# EAGLE design team13 (EAGLE 8.6.3)
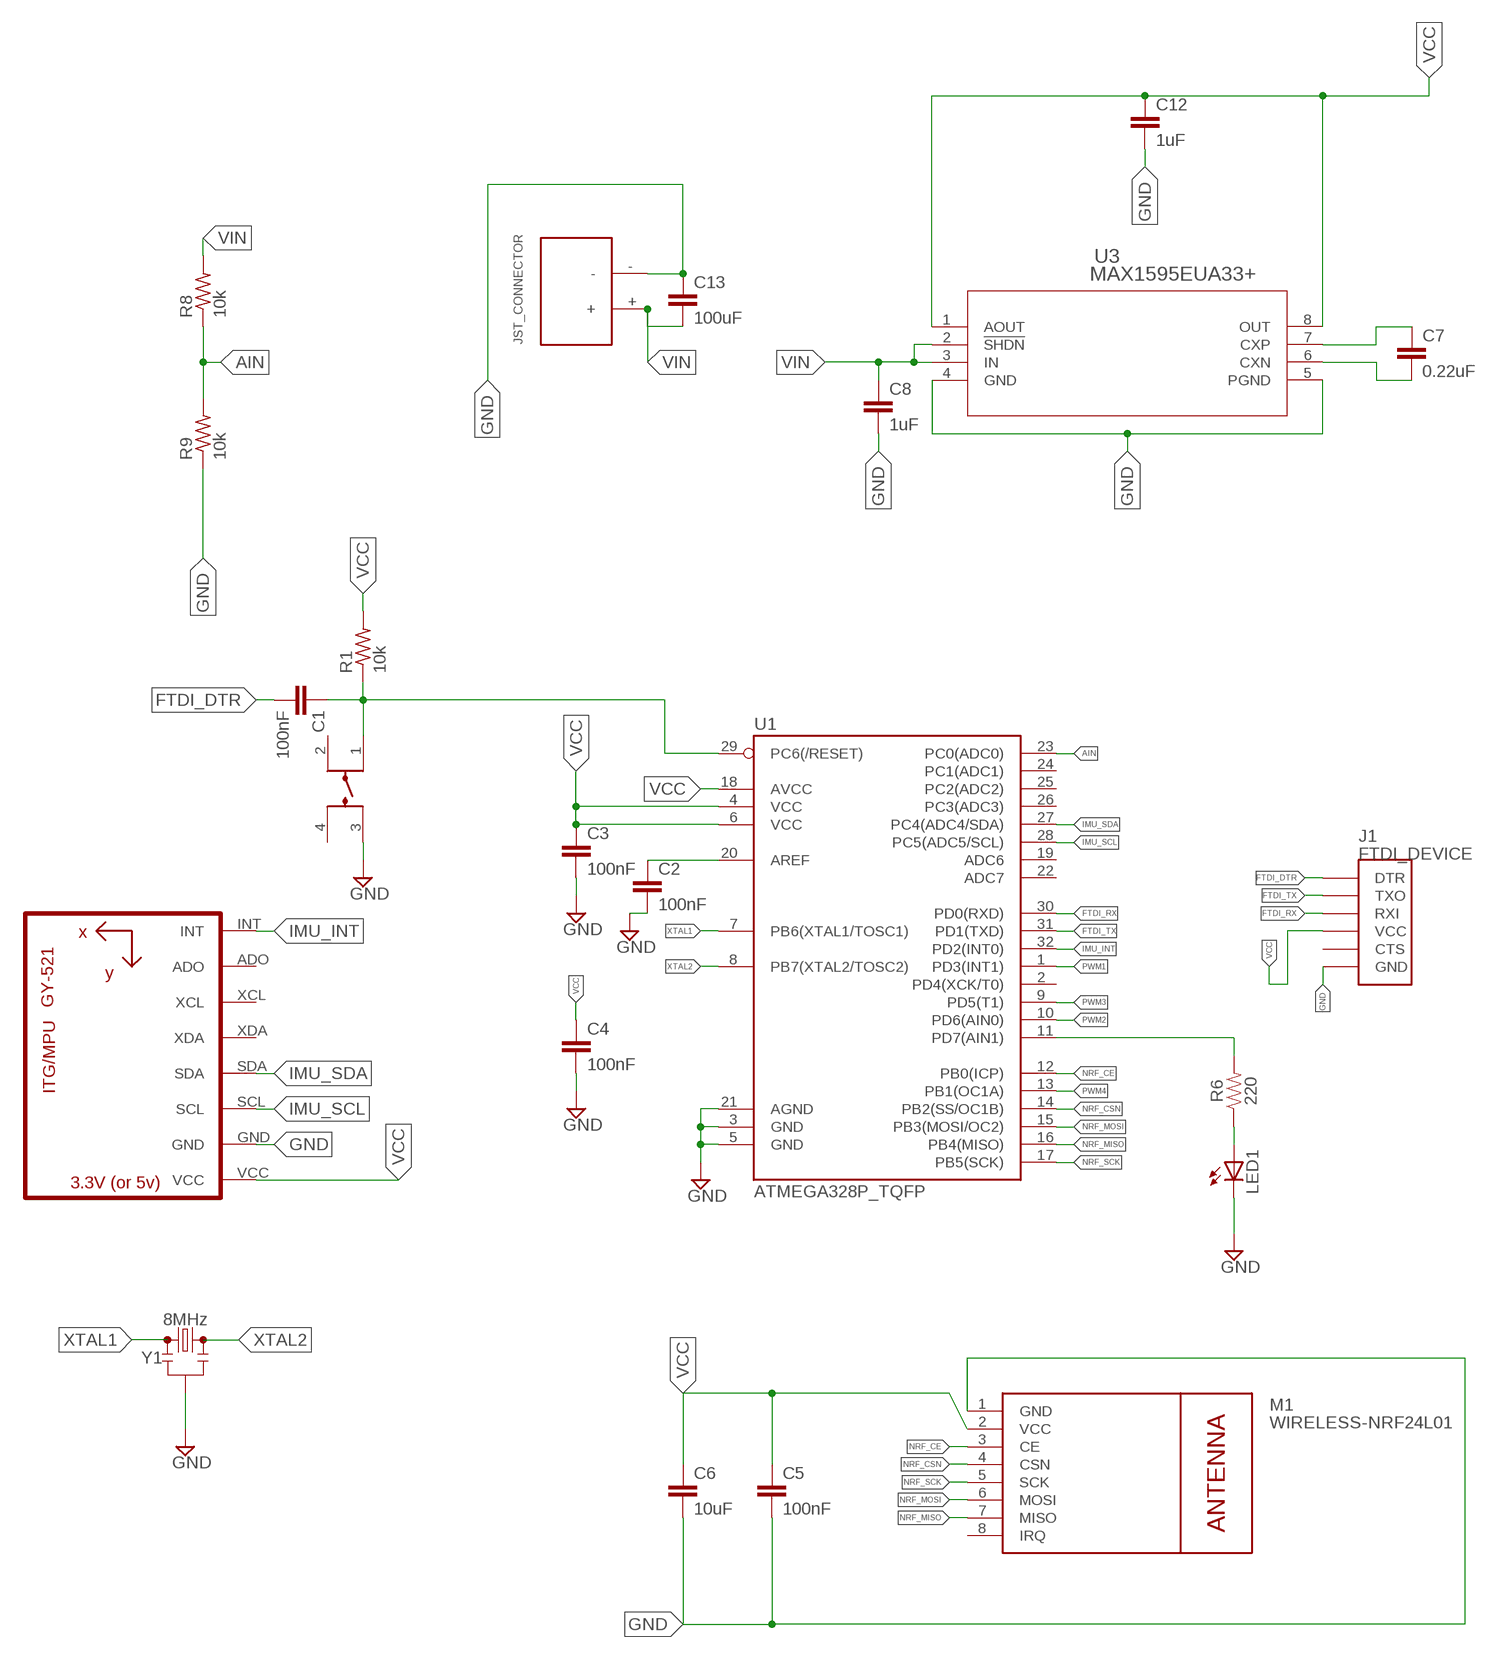
[diagram p0: schematic, sheet 1, part 1 of 3]
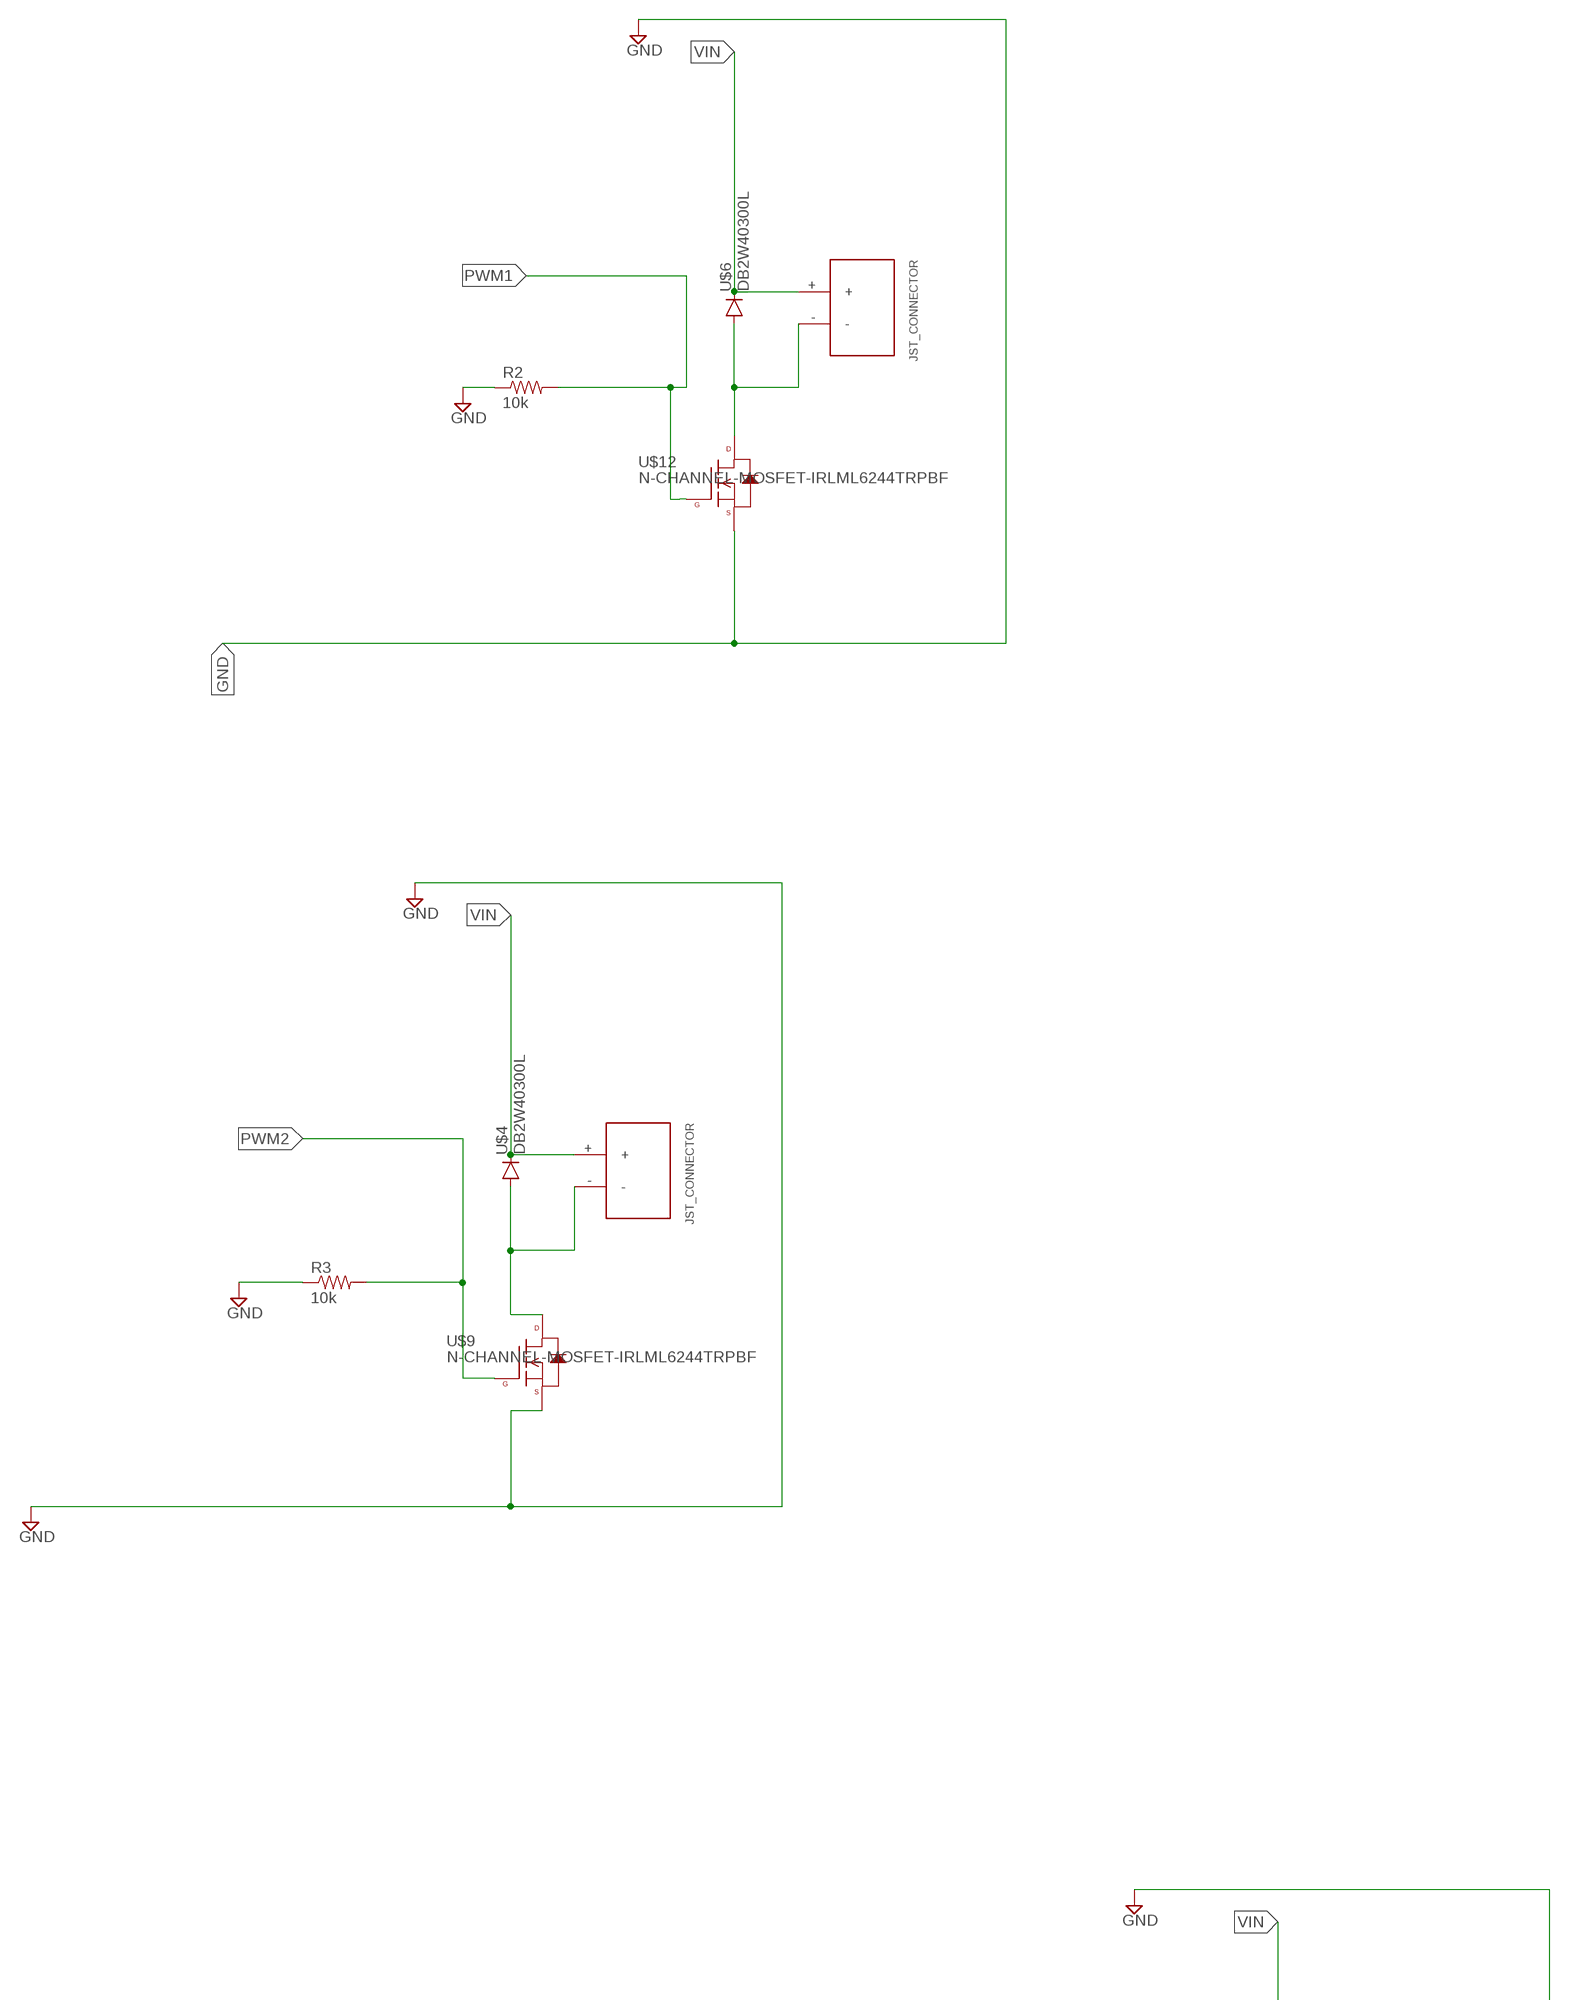
[diagram p1: schematic, sheet 1, part 2 of 3]
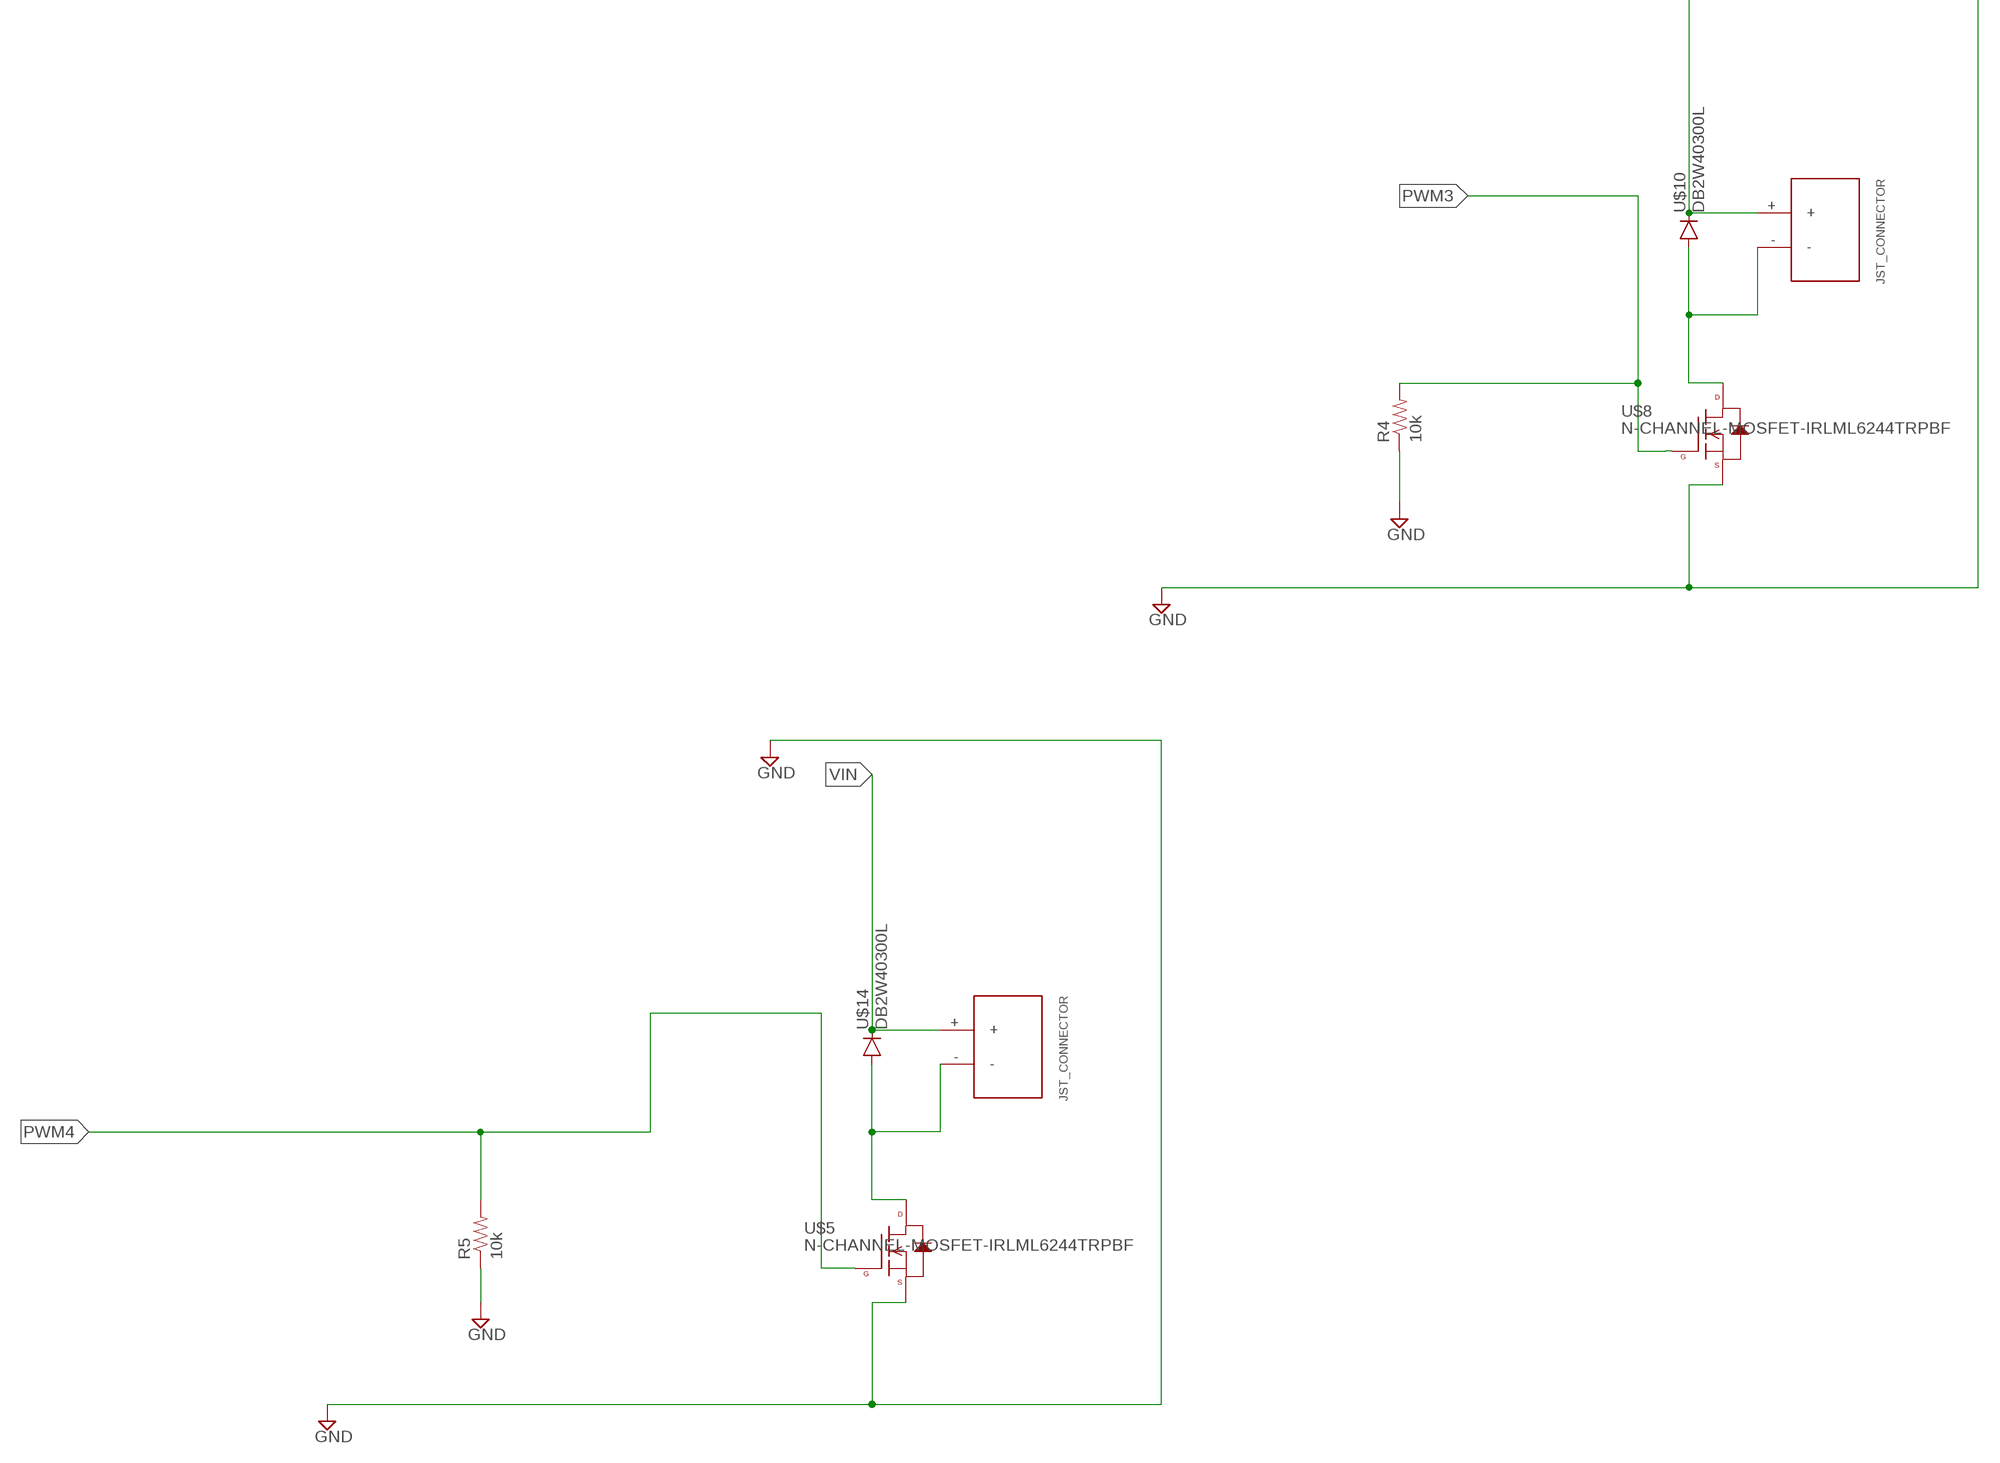
[diagram p2: schematic, sheet 1, part 3 of 3]

## Parts
C1  100nF  C-EUC0603  [C0603]
C2  100nF  C-EUC0603  [C0603]
C3  100nF  C-EUC0603  [C0603]
C4  100nF  C-EUC0603  [C0603]
C5  100nF  C-EUC0603  [C0603]
C6  10uF  C-EUC0603  [C0603]
C7  0.22uF  C-EUC0603  [C0603]
C8  1uF  C-EUC0603  [C0603]
C12  1uF  C-EUC0603  [C0603]
C13  100uF  C-EUC1206  [C1206]
J1  FTDI_DEVICE  [FTDI_DEVICE_SIDE]
LED1  LED1206  [LED-1206]
M1  WIRELESS-NRF24L01  [WIRELESS-NRF24L01]
R1  10k  R-US_R0603  [R0603]
R2  10k  RESISTOR0603  [0603-RES]
R3  10k  RESISTOR0603  [0603-RES]
R4  10k  RESISTOR0603  [0603-RES]
R5  10k  RESISTOR0603  [0603-RES]
R6  220  220OHM-0603-1/10W-1%  [0603]
R8  10k  R-US_R0603  [R0603]
R9  10k  R-US_R0603  [R0603]
U1  ATMEGA328P_TQFP  [TQFP32-08]
U2  GY-521MPU6050  [GY-521]
U3  MAX1595EUA33+  [21-0036K]
U$1  LL3301NF065QG  [LL3301NF065QG]
U$3  JST_CONNECTOR_FEMALE  [JST_CONNECTOR_FEMALE]
U$4  DB2W40300L  [MINI2-F3-B]
U$5  N-CHANNEL-MOSFET-IRLML6244TRPBF  [SOT23-3]
U$6  DB2W40300L  [MINI2-F3-B]
U$7  JST_CONNECTOR_FEMALE  [JST_CONNECTOR_FEMALE]
U$8  N-CHANNEL-MOSFET-IRLML6244TRPBF  [SOT23-3]
U$9  N-CHANNEL-MOSFET-IRLML6244TRPBF  [SOT23-3]
U$10  DB2W40300L  [MINI2-F3-B]
U$11  JST_CONNECTOR_FEMALE  [JST_CONNECTOR_FEMALE]
U$12  N-CHANNEL-MOSFET-IRLML6244TRPBF  [SOT23-3]
U$14  DB2W40300L  [MINI2-F3-B]
U$15  JST_CONNECTOR_FEMALE  [JST_CONNECTOR_FEMALE]
U$19  JST_CONNECTOR_FEMALE  [JST_CONNECTOR_FEMALE]
Y1  8MHz  RESONATOR-8MHZSMD_3.2X1.3  [RESONATOR-SMD-3.2X1.3]

## Nets
AIN: R8.1 R9.2 U1.23(PC0(ADC0))
FTDI_DTR: C1.2 J1.P$1(DTR)
FTDI_RX: J1.P$3(RXI) U1.30(PD0(RXD))
FTDI_TX: J1.P$2(TXO) U1.31(PD1(TXD))
GND: C2.2 C3.2 C4.2 C5.2 C6.2 C8.2 C12.2 C13.1 J1.P$6(GND) LED1.C M1.1(GND) R2.1 R3.1 R4.1 R5.1 R9.1 U1.3(GND) U1.5(GND) U1.21(AGND) U2.GND U3.4(GND) U3.5(PGND) U$1.3 U$5.2(S) U$8.2(S) U$9.2(S) U$12.2(S) U$19.- Y1.2
IMU_INT: U1.32(PD2(INT0)) U2.INT
IMU_SCL: U1.28(PC5(ADC5/SCL)) U2.SCL
IMU_SDA: U1.27(PC4(ADC4/SDA)) U2.SDA
N$1: C1.1 R1.1 U1.29(PC6(/RESET)) U$1.1
N$2: C2.1 U1.20(AREF)
N$5: U$3.- U$4.POS(PPIN) U$9.3(D)
N$6: C7.1 U3.7(CXP)
N$7: R6.2 U1.11(PD7(AIN1))
N$9: U$6.POS(PPIN) U$7.- U$12.3(D)
N$10: C7.2 U3.6(CXN)
N$11: LED1.A R6.1
N$13: U$8.3(D) U$10.POS(PPIN) U$11.-
N$17: U$5.3(D) U$14.POS(PPIN) U$15.-
NRF_CE: M1.3(CE) U1.12(PB0(ICP))
NRF_CSN: M1.4(CSN) U1.14(PB2(SS/OC1B))
NRF_MISO: M1.7(MISO) U1.16(PB4(MISO))
NRF_MOSI: M1.6(MOSI) U1.15(PB3(MOSI/OC2))
NRF_SCK: M1.5(SCK) U1.17(PB5(SCK))
PWM1: R2.2 U1.1(PD3(INT1)) U$12.1(G)
PWM2: R3.2 U1.10(PD6(AIN0)) U$9.1(G)
PWM3: R4.2 U1.9(PD5(T1)) U$8.1(G)
PWM4: R5.2 U1.13(PB1(OC1A)) U$5.1(G)
VCC: C3.1 C4.1 C5.1 C6.1 C12.1 J1.P$4(VCC) M1.2(VCC) R1.2 U1.4(VCC) U1.6(VCC) U1.18(AVCC) U2.VCC U3.1(AOUT) U3.8(OUT)
VIN: C8.1 C13.2 R8.2 U3.2(!SHDN) U3.3(IN) U$3.+ U$4.NEG(GPIN) U$6.NEG(GPIN) U$7.+ U$10.NEG(GPIN) U$11.+ U$14.NEG(GPIN) U$15.+ U$19.+
XTAL1: U1.7(PB6(XTAL1/TOSC1)) Y1.1
XTAL2: U1.8(PB7(XTAL2/TOSC2)) Y1.3
Unconnected: J1.P$5(CTS) M1.8(IRQ) U1.2(PD4(XCK/T0)) U1.19(ADC6) U1.22(ADC7) U1.24(PC1(ADC1)) U1.25(PC2(ADC2)) U1.26(PC3(ADC3)) U2.ADO U2.XCL U2.XDA U$1.2 U$1.4

## Library data of the parts
C1-C8 C12 C13 = rcl:C-EU: CAPACITOR, European symbol; SPICEPREFIX: C
J1 = quad:FTDI_DEVICE: Connector which mates to FTDI basic or FTDI cable.
LED1 = LilyPad-Wearables:LED: LEDs Standard schematic elements and footprints for 5mm, 3mm, 1206, and 0603 sized LEDs. 5mm - Spark Fun Electronics SKU : Comp-SBL
M1 = quad:WIRELESS-NRF24L01: 2.4 GHz Wireless Module based on NRF24L01 chip
R1 R8 R9 = rcl:R-US_: RESISTOR, American symbol; SPICEPREFIX: R
R2-R5 = SparkFun-Resistors:RESISTOR: Resistor Basic schematic elements and footprints for 0603, 1206, and PTH resistors.
R6 = SparkFun-Resistors:220OHM: 220Ω resistor A resistor is a passive two-terminal electrical component that implements electrical resistance as a circuit element. Resistors act to reduce current flow, and, at the same time, act to lower voltage levels within circuits. - Wikipedia; PROD_ID: RES-07861
U1 = quad:ATMEGA328P_TQFP; PROD_ID: IC-09069
U2 = quad:GY-521
U3 = MAX1595EUA33+:MAX1595EUA33+; MANUFACTURER_PART_NUMBER: MAX1595EUA33+; VENDOR: Maxim Integrated Products
U$1 = E-Switch:LL3301NF065QG
U$3 U$7 U$11 U$15 U$19 = quad:JST_CONNECTOR_FEMALE
U$4 U$6 U$10 U$14 = quad:DB2W40300L
U$5 U$8 U$9 U$12 = quad:N-CHANNEL-MOSFET: N-Channel MOSFET Mode Field Effect Transistor; DATASHEET: http://www.mouser.com/ds/2/196/irlml6244pbf-936666.pdf; MOUSER: 942-IRLML6244TRPBF; URL: http://www.mouser.com/Search/ProductDetail.aspx?R=IRLML6244TRPBFvirtualkey57370000virtualkey942-IRLML6244TRPBF
Y1 = SparkFun-Clocks:RESONATOR-8MHZ: 8MHz Resonator Digikey Example <http://www.digikey.com/product-detail/en/murata-electronics-north-america/CSTCE10M0G55-R0/490-1196-1-ND/584633> Frequency: 8MHz Frequency Stability: ±0.2% Frequency Tolerance: ±0.5% Capacitance: 33pF SparkFun Products Arduino Pro Mini 328- 3.3V/8MHz <https://www.sparkfun.com/products/11114> SparkFun Digital Sandbox <https://www.sparkfun.com/products/12651>; PROD_ID: XTAL-08895

## Board
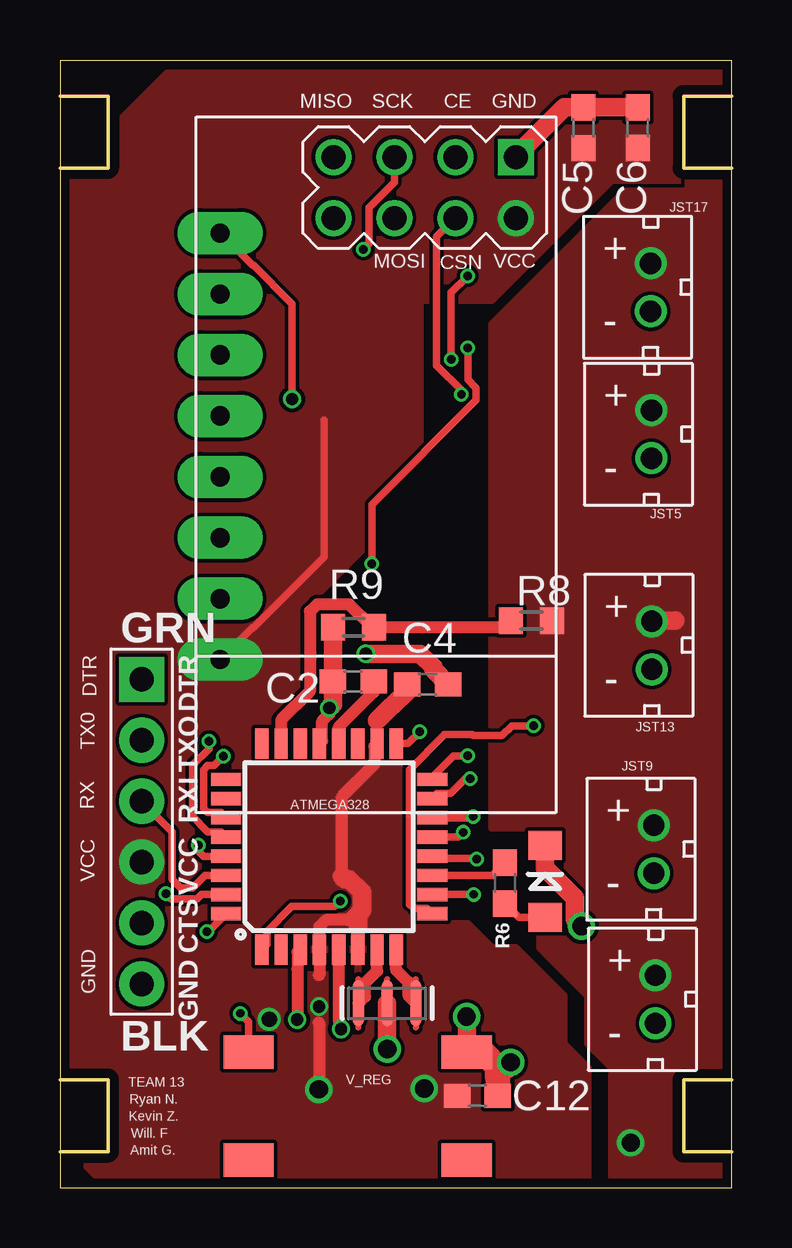
[diagram p3: board, top side]
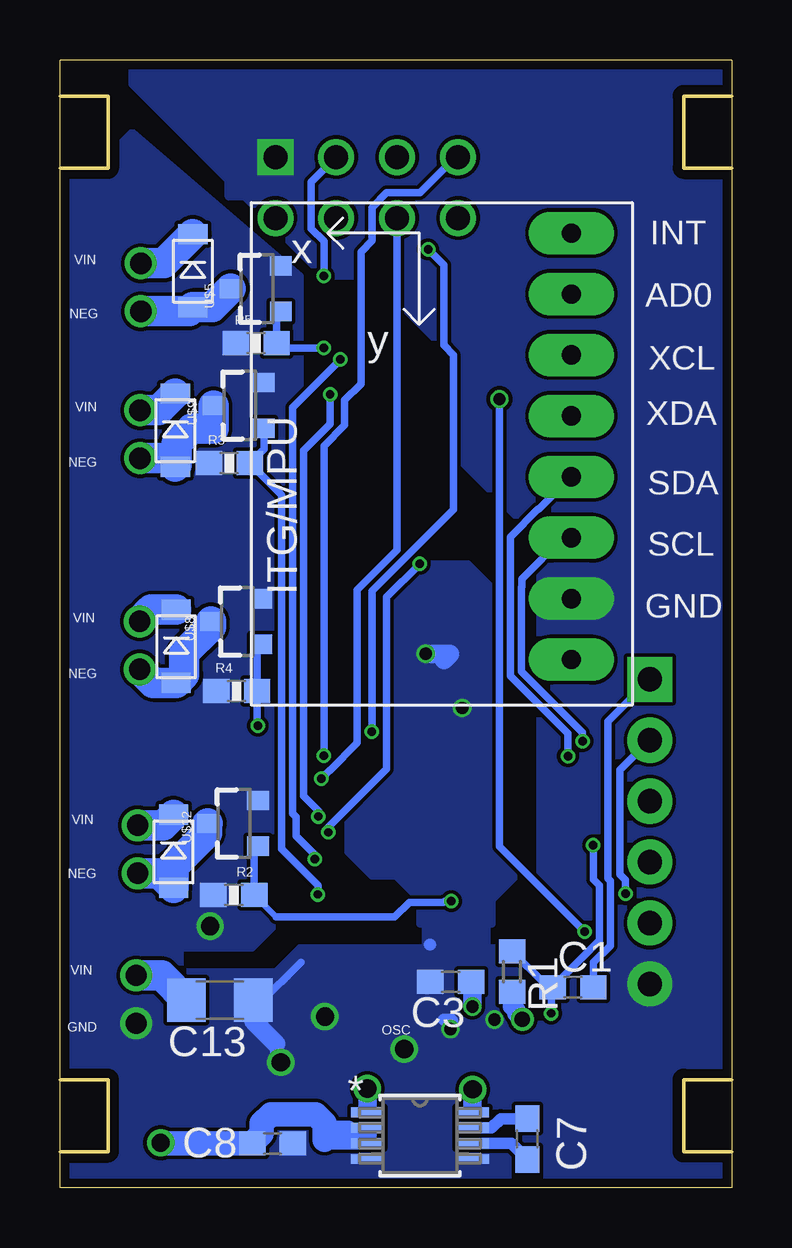
[diagram p4: board, bottom side, seen from below]

Size 28 x 47 mm. Coordinates in mm from the lower left corner, seen from the top.
Outline: 28,1.5 28,0 0,0 0,1.5
Outline: 28,1.5 28,4.5
Outline: 28,4.5 28,42.5
Outline: 28,42.5 28,45.5
Outline: 28,45.5 28,47 0,47 0,45.5
Outline: 0,45.5 0,42.5
Outline: 0,42.5 0,4.5
Outline: 0,4.5 0,1.5
Outline: 28,45.5 26,45.5 26,42.5 28,42.5
Outline: 28,1.5 26,1.5 26,4.5 28,4.5
Outline: 0,1.5 2,1.5 2,4.5 0,4.5
Outline: 0,45.5 2,45.5 2,42.5 0,42.5
Copper layers (1*16): Top 0.035559375mm / dielectric 1.6mm / Bottom 0.035559375mm
Design rules "oshpark-2layer": minimum track width 6mil, minimum drill 10mil, track to track 6mil, track to pad 6mil, pad to pad 6mil, via to via 6mil, smd to smd 6mil, copper to edge 15mil, drill to drill 6mil, minimum pad ring 5mil, minimum via ring 5mil, stop-mask expansion 2.5mil, vias tented up to drill 0mil, thermal gap 10mil

### Footprints (pad centres in the part's own frame; a part is rotated, then mirrored left to right if it is on the bottom)
C0603 = smd 1.1 x 1: 1 -0.85,0; 2 0.85,0
C1206 = smd 1.6 x 1.8: 1 -1.4,0; 2 1.4,0
FTDI_DEVICE_SIDE = drill 1.016 pad 1.88 square: P$1 -6.35,0 | drill 1.016 pad 1.88: P$2 -3.81,0; P$3 -1.27,0; P$4 1.27,0; P$5 3.81,0; P$6 6.35,0
LED-1206 = smd 1.2 x 1.4: A -1.5,0; C 1.5,0
WIRELESS-NRF24L01 = drill 1 square: 1 -12.7,6.35 | drill 1: 2 -10.16,6.35; 3 -12.7,3.81; 4 -10.16,3.81; 5 -12.7,1.27; 6 -10.16,1.27; 7 -12.7,-1.27; 8 -10.16,-1.27
R0603 = smd 1 x 1.1: 1 -0.85,0; 2 0.85,0
0603-RES = smd 1.1 x 1: 1 -0.85,0; 2 0.85,0
0603 = smd 1.1 x 1: 1 -0.85,0; 2 0.85,0
TQFP32-08 = smd 1.27 x 0.559: 1 -4.293,2.8; 2 -4.293,2; 3 -4.293,1.2; 4 -4.293,0.4; 5 -4.293,-0.4; 6 -4.293,-1.2; 7 -4.293,-2; 8 -4.293,-2.8; 17 4.293,-2.8; 18 4.293,-2; 19 4.293,-1.2; 20 4.293,-0.4; 21 4.293,0.4; 22 4.293,1.2; 23 4.293,2; 24 4.293,2.8 | smd 0.559 x 1.27: 9 -2.8,-4.293; 10 -2,-4.293; 11 -1.2,-4.293; 12 -0.4,-4.293; 13 0.4,-4.293; 14 1.2,-4.293; 15 2,-4.293; 16 2.8,-4.293; 25 2.8,4.293; 26 2,4.293; 27 1.2,4.293; 28 0.4,4.293; 29 -0.4,4.293; 30 -1.2,4.293; 31 -2,4.293; 32 -2.8,4.293
GY-521 = drill 0.8 pad 1.778 long: ADO -8.89,-6.35; GND -8.89,6.35; INT -8.89,-8.89; SCL -8.89,3.81; SDA -8.89,1.27; VCC -8.89,8.89; XCL -8.89,-3.81; XDA -8.89,-1.27
21-0036K = smd 1.372 x 0.406: 1 -2.184,0.975; 2 -2.184,0.325; 3 -2.184,-0.325; 4 -2.184,-0.975; 5 2.184,-0.975; 6 2.184,-0.325; 7 2.184,0.325; 8 2.184,0.975
LL3301NF065QG = smd 2.1 x 1.4: 1 0,0; 2 0,-4.5; 3 9.1,0; 4 9.1,-4.5
JST_CONNECTOR_FEMALE = drill 0.889: + 0,1; - 0,-1
MINI2-F3-B = smd 1.22 x 0.85: NEG 0,1.55; POS 0,-1.5
SOT23-3 = smd 0.8 x 0.9: 1 -0.95,-1; 2 0.95,-1; 3 0,1.1
RESONATOR-SMD-3.2X1.3 = smd 0.45 x 1.905: 1 -1.2,0; 2 0,0; 3 1.2,0

### Placement (x,y rotation side)
C1  6.61,8.35 0 bottom
C2  12.22,21.1 180 top
C3  11.71,8.58 180 bottom
C4  15.33,20.97 0 top
C5  21.83,44.17 90 top
C6  24.08,44.18 90 top
C7  8.52,2.02 270 bottom
C8  19.14,1.83 0 bottom
C12  17.41,3.83 0 top
C13  21.33,7.81 180 bottom
J1  3.4,14.84 270 top
LED1  20.23,12.76 90 top
M1  12.67,30.25 270 top
R1  9.15,9 270 bottom
R2  20.75,12.19 0 bottom
R3  20.94,30.19 0 bottom
R4  20.63,20.69 0 bottom
R5  19.82,35.19 0 bottom
R6  18.56,12.69 90 top
R8  19.66,23.63 0 top
R9  12.24,23.36 0 top
U1  11.22,14.21 90 top
U2  15.57,30.89 180 bottom
U3  12.99,2.17 0 bottom
U$1  7.87,5.65 0 top
U$3  24.66,31.4 0 top
U$4  23.19,31.55 0 bottom
U$5  19.79,37.47 90 bottom
U$6  23.27,13.99 0 bottom
U$7  24.76,14.1 0 top
U$8  20.61,23.59 90 bottom
U$9  20.5,32.6 90 bottom
U$10  23.16,22.54 0 bottom
U$11  24.68,22.6 0 top
U$12  20.74,15.18 90 bottom
U$14  22.46,38.19 0 bottom
U$15  24.63,37.52 0 top
U$19  24.82,7.84 0 top
Y1  13.64,7.68 0 top

### Tracks (layer width: path | path; a pad name or v marks a point on that pad's centre or on a via)
AIN
  Top 0.508: U1.23 9.22,19.49 10.42,20.69 10.42,24.01 10.72,24.31 12.06,24.31 13.01,23.36 R9.2 18.53,23.36 R8.1
FTDI_DTR
  Bottom 0.305: C1.2 5.76,9.38 5.05,10.08 5.05,12.78 5.16,12.89 5.16,19.43 J1.P$1
FTDI_RX
  Top 0.305: J1.P$3 4.68,14.83 4.68,12.85 5.04,12.49 5.54,12.49 6.05,13.01 U1.30
FTDI_TX  (via drill 0.35)
  Top 0.305: U1.31 5.9,12.21 5.73,12.04 4.63,12.04 v4.42,12.24
  Bottom 0.305: v4.42,12.24 4.42,12.82 4.65,13.05 4.65,17.4 J1.P$2
GND  (via drill 0.51, 0.76)
  Top 0.305: 12.53,22.25 v12.75,22.25
  Top 0.508: U1.21 10.93,18.62 10.93,19.44 11.23,19.73 v11.23,19.99 | U1.5 11.62,6.97 11.64,6.95 11.64,6.68 v11.71,6.61 | U1.3 9.91,9.8 9.91,9.11 9.9,9.11 9.9,6.95 9.89,6.96 v9.89,7
  Top 0.762: C4.2 15.56,21.59 15.56,21.69 15,22.25 v12.75,22.25 | v11.23,19.99 11.38,20.14 C2.2 11.38,23.34 R9.1 | Y1.2 v13.64,5.78 | U$1.3 16.96,7.11 v16.95,7.12 | M1.1 19.02,43.02 21.02,45.02 C5.2 C6.2 | LED1.C 20.23,13.31 21.46,12.08 21.46,11.17 v21.74,10.89 | 18.25,4.59 18.23,4.62
  Top 1.016: 18.23,5.05 18.23,4.62 | 18.23,5.05 17.63,5.65 U$1.3 | C12.2 18.25,4.59 | v18.79,5.22 18.62,5.05 18.23,5.05
  Bottom 0.305: C13.1 19.68,7.67 17.95,9.39
  Bottom 0.508: 12.57,10.13 | 11.64,6.95 11.69,7 12,7 | 18.82,5.37 19,5.55 19,6
  Bottom 0.762: v12.75,22.25 11.75,22.25 12,22 | 19,6 19.93,6.93
  pour Bottom (no thermals): 28,10.5 28,43.5 27,44.5 18.5,37.5 20,36 20,34.5 18.5,33 18.5,29.5 20,28 20,26 18.5,24.5 18.5,20 19.5,19 19.5,17 18.5,16 18.5,11.5 20,10 27.5,10
  pour Bottom: 10.31,12.14 10.31,9.91 12.65,9.91 12.65,12.14 12.62,12.17 10.31,12.17
  pour Bottom (no thermals): 11,1 23,1 24,2 24,7 23,8 22,9 14,9 13,10 8,10 7,11 7,30 15,38 15,46 4,46 3,45 3,43 2,42 1,41 1,6 2,5 3,4 3,2 4,1
  pour Bottom: 13,10 18,10 19,9 14,9
  pour Bottom (no thermals): 9,10 8,11 8,27 12,31 12,35 9,35 6,38 2,38 2,10
  pour Bottom (no thermals): 10,25 11,26 15,26 16,25 16,14 15,13 14,13 13,12 13,11 10,11 10,12 9,13 9,24
  pour Bottom (no thermals): 15,45 13,47 0,47 0,7 3,4 5,4 6,5 6,38 7,39 14,39 15,40
  pour Bottom (no thermals): 23,5 26,5 28,7 28,10 23,10
  pour Bottom (no thermals): 24,5 18,5 18,9 24,9
  pour Bottom: 28,9 28,0 22,0 22,9
  pour Bottom (no thermals): 19,37 18,38 25,44 26,43 26,37
  pour Bottom (no thermals): 18,38 18,12 20,10 23,10 23,38
  pour Bottom: 14,2 14,0.33 14.01,0.32 22.87,0.32 22.91,0.28 22.91,6.05 22.97,6.11 14.21,6.11 14.12,6.01 14.12,2.62 14.13,2.6 14.01,2.48 14.01,2.44 14,2.42
  pour Bottom: 24.25,41.76 27.69,41.76 27.69,34.57 17.37,34.57 17.16,34.36
  pour Bottom: 28,35 11,35 10,36
  pour Bottom (no thermals): 0,8 0,0 21,0 21,9 1,9
  pour Bottom (no thermals): 12,47 21,47 21,41.34 20.97,41.31 20.31,41.31 20,41 17,38 11,38 11,47
  pour Bottom (no thermals): 20,41 25,46 25,47 19,47 19,41
IMU_INT  (via drill 0.35, 0.51)
  Top 0.305: 6.53,11.41 U1.32 6.18,10.66 v6.12,10.66 | U2.INT 8.03,38.44 8.06,38.44 9.68,36.83 v9.68,32.87
  Bottom 0.305: v6.12,10.66 9.68,14.22 9.68,28.3 v9.68,32.87
IMU_SCL  (via drill 0.35)
  Top 0.305: U1.28 6.71,14.83 6.17,14.83 5.53,15.46 5.53,17.61 6.21,18.29 v6.21,18.61
  Bottom 0.305: v6.21,18.61 6.21,18.96 8.76,21.51 8.76,25.04 8.75,25.05 8.75,25.38 7.04,27.09 U2.SCL
IMU_SDA  (via drill 0.35)
  Top 0.305: U1.27 6.71,15.63 6.17,15.63 5.99,15.8 5.99,17.42 6.17,17.59 6.43,17.59 v6.82,17.98
  Bottom 0.305: v6.82,17.98 6.82,18.92 9.22,21.32 9.22,27.12 8.06,28.28 8.03,28.28 U2.SDA
N$1  (via drill 0.35)
  Top 0.305: U1.29 6,13.81 5.77,14.04 v5.77,14.27 | U$1.1 7.87,6.92 v7.52,7.26
  Bottom 0.305: C1.1 5.54,10.27 5.51,10.27 5.51,12.59 5.77,12.85 v5.77,14.27 | C1.1 7.46,8.51 7.81,8.51 R1.1 | v7.52,7.26 7.52,8.29 C1.1
N$2
  Top 0.508: U1.20 11.62,19.19 13.07,20.65 C2.1
N$5
  Bottom 1.27: U$3.- 23.55,30.4 U$4.POS 23.13,30.11 23.13,31.02 22.51,31.64 21.6,31.64 U$9.3
N$6
  Bottom 0.483: U3.7 10.01,2.49 9.62,2.88 C7.1
N$7
  Top 0.305: U1.11 18.03,13.01 R6.2
N$9
  Bottom 0.305: 21.84,14.88 U$12.3
  Bottom 1.27: U$12.3 21.87,15.15 21.87,14.79 23.27,13.39 U$6.POS 23.88,13.1 U$7.-
N$10
  Bottom 0.483: U3.6 9.19,1.84 C7.2
N$11
  Top 0.305: LED1.A 19.14,11.26 R6.1
N$13
  Bottom 1.27: U$11.- 24.12,21.04 U$10.POS 22.82,21.38 22.82,22.28 21.7,23.39 U$8.3
N$17
  Bottom 1.27: U$15.- 22.62,36.52 U$14.POS 21.66,36.69 U$5.3
NRF_CE  (via drill 0.35)
  Top 0.305: U1.12 15.61,13.72 17.35,13.72 v17.37,13.69 | v16.31,34.52 16.31,37.31 v17,38
  Bottom 0.305: v17.37,13.69 17.37,13.87 18.16,14.66 18.16,15.44 18.31,15.59 18.31,32.52 v16.31,34.52 | v17,38 17,39.44 17.54,39.98 17.54,41.9 M1.3
NRF_CSN  (via drill 0.35)
  Top 0.305: 16.76,33.1 v16.74,33.07 16.74,33.23 15.7,34.27 15.7,39.63 M1.4 | v17.22,15.47 17.16,15.41 U1.14
  Bottom 0.305: v16.74,33.07 16.74,31.82 17.85,30.71 17.85,16.33 17.22,15.7 v17.22,15.47
NRF_MISO  (via drill 0.35)
  Top 0.305: U1.16 15.47,17.05 16.41,18 v17,18
  Bottom 0.305: v17,18 17,30.92 16.13,31.78 16.13,32.82 15.46,33.49 15.46,39 14.99,39.46 14.99,40.85 14.38,41.47 12.99,41.47 11.5,42.95 M1.7
NRF_MOSI  (via drill 0.35)
  Top 0.305: U1.15 15.73,16.43 16.27,16.43 16.9,17.05 v17.1,17.05
  Bottom 0.305: v17.1,17.05 16.76,17.39 16.75,17.39 15.61,18.54 15.61,24.9 13.94,26.57 13.94,37 M1.6
NRF_SCK  (via drill 0.35)
  Top 0.305: v15,19 14.5,18.5 U1.17 | v12.65,39.1 12.88,39.34 12.88,40.85 13.94,41.91 M1.5
  Bottom 0.305: v12.65,39.1 12,38.45 12,35.12 11.59,34.71 11.59,28.27 15,24.86 v15,19
PWM1  (via drill 0.35)
  Top 0.305: U1.1 8.64,10.13 8.64,10.68 9.67,11.71 11.46,11.71 v11.68,11.94
  Bottom 0.254: R2.2 18.99,11.28
  Bottom 0.305: 18.99,11.28 14.05,11.28 13.44,11.89 12.01,11.89 11.97,11.94 v11.68,11.94 | U$12.1 19.9,14.07 R2.2
PWM2  (via drill 0.35)
  Top 0.305: U1.10 v17.24,12.21 v17.25,12.22 17.27,12.24
  Bottom 0.305: v17.25,12.22 17.25,12.6 18.77,14.12 18.77,28.87 R3.2 19.5,30.78 U$9.1
PWM3  (via drill 0.35)
  Top 0.305: U1.9 15.3,11.63 14.75,11.63 14.57,11.8 14.57,17.42 16.03,18.88 17.18,18.88 17.21,18.84 18.43,18.84 18.84,19.25 v19.75,19.25
  Bottom 0.305: U$8.1 19.78,22.28 R4.2 | R4.2 19.78,20.52 19.8,20.5 | v19.75,19.25 19.78,19.28 R4.2
PWM4  (via drill 0.35)
  Top 0.305: 15.56,14.56 U1.13 16.62,14.61 v16.82,14.8 | v13,26 13,28.47 17.34,32.82 17.34,33.32 17,33.67 v17,35
  Bottom 0.305: U$5.1 18.97,36.34 R5.2 18.78,35 v17,35 | v16.82,14.8 16.82,15.02 14.39,17.44 14.39,24.61 v13,26
VCC  (via drill 0.51, 0.64, 0.76)
  Top 0.305: U2.VCC 8.03,23.35 8.06,23.35 11,26.29 11,32
  Top 0.508: 12.01,11.15 11.1,11.15 10.82,10.87 U1.4 10.82,8.87 10.8,8.85 | 12.01,11.15 12.09,11.15 12.42,10.82 U1.6 | 13.23,18.52 U1.18 | U1.18 13.11,18.39 13.11,17.64 11.76,16.3 11.76,12.97 12.47,12.26 12.47,11.61 12.01,11.15 | U1.18 13.22,19.47 13.22,19.48 | 10.83,6.77 10.8,6.88 10.8,3.85 v10.79,4.09
  Top 0.762: 12.42,10.82 12.42,11.38 12.6,11.56 12.6,12.31 12.06,12.85 11.88,12.85 11.76,12.97 | 13.22,19.47 13.82,20.07 13.85,20.07 14.48,20.7 C4.1 | v15.19,4.13 15.22,4.03
  Bottom 0.508: 10.81,3.4 U3.8 | 15.17,3.4 U3.1
  Bottom 0.762: R1.2 9.15,7.56 8.97,7.38 8.97,7.26 v8.72,7.01 | v15.19,4.13 15.17,4.04 15.17,3.4 | v10.79,4.09 10.81,3.97 10.81,3.4 | 10.76,8.48 C3.1 10.8,8.53 v10.8,7.54
  pour Top: 12,17 11,17 10,16 10,13 11,12 12,12 13,13 13,16
  pour Top: 1,41 3,43 3,44 5,46 6,46 7,45 10,42 10,26 6,22 6,11 8,9 17,9 18,8 18,7 21,4 21,2 20,1 4,1 3,2 3,5 2,6 1,7
  pour Top: 16,8 16,18 7,18 7,8
  pour Top (no thermals): 0,2 2,0 7,0 9,2 10,3 10,10 5,15 5,22 6,23 10,27 10,45 10,46 9,47 5,47 0,42
  pour Top: 9,40 13,36 13,31 9,27
  pour Top (no thermals): 10,16 10,25 9,26 1,26 1,13 10,13
  pour Top: 21,3 21,6 21,8 19,10 18,10 17,11 8,11 8,3
  pour Top: 21,2 22,3 22,5 21,6 16,6 16,2
  pour Top (no thermals): 10,38 15,38 15,29 9,23 9,38
  pour Top: 9,40 18,40 20,42 20,47 9,47
  pour Top (no thermals): 22,4 22,0 6,0 6,4
  pour Top: 16,46 21,46 21,41 20,41 19,40 11,40 11,46
  pour Top: 9,46 24,46 24,43 18,37 17,37 17,40 16,41 9,41
  pour Top (no thermals): 18,47 25,47 25,44 18,37 11,37 11,47
  pour Top (no thermals): 21,42 28,42 28,47 20,47 20,42
  pour Top (no thermals): 10,38 18,38 20,40 20,42 10,42
  pour Top (no thermals): 18,5 15,5 15,3 18,3
VIN  (via drill 0.76)
  Top 0.762: 25.65,23.63 U$11.+
  Bottom 0.305: U3.3 15.17,2.21 U3.2
  Bottom 0.508: 16.96,2 16.8,1.84 U3.3
  Bottom 0.762: 15.17,2.21 15.38,2 16.96,2 16.56,2.4 15.99,2.4
  Bottom 1.016: 16.96,2 16.96,2.67 17.35,3.06 19.2,3.06 19.59,2.67 19.59,2.24 C8.1 23.77,1.83 v23.8,1.86
  Bottom 1.27: U$11.+ 24.19,24.09 U$10.NEG | U$3.+ 23.89,32.4 U$4.NEG | U$15.+ 23.68,38.52 U$14.NEG | U$6.NEG 23.7,15.1 U$7.+ | C13.2 23.77,8.85 U$19.+
  pour Top (rank 2, no thermals): 22,6 22,10 19,13 28,6
  pour Top: 28,2 26,2 25,1 24,1 23,2 23,5 22,6 22,7
  pour Top: 23,2 23,0 28,0 28,10 22,10 22,6 23,5
  pour Top (rank 2, no thermals): 18,36 18,25 18,15 20,15 20,10 21,9 22,8 23,8 26,8 28,6 28,44 26,44
XTAL1
  Top 0.508: Y1.1 12.73,7.97 12.73,8.54 13.22,9.03 U1.7
XTAL2
  Top 0.508: Y1.3 14.54,7.99 14.54,8.55 14.02,9.07 U1.8

### Text on the board
tPlace: MISO | SCK | CE | GND | JST17 | MOSI | CSN | VCC | JST5 | DTR | JST13 | TX0 | JST9 | RX | ATMEGA328 | VCC | GND | TEAM 13 | V_REG | Kevin Z. | Ryan N. | Will. F | Amit G.
bPlace: INT | VIN | AD0 | NEG | XCL | XDA | VIN | NEG | SDA | SCL | GND | VIN | NEG | VIN | NEG | VIN | OSC | GND